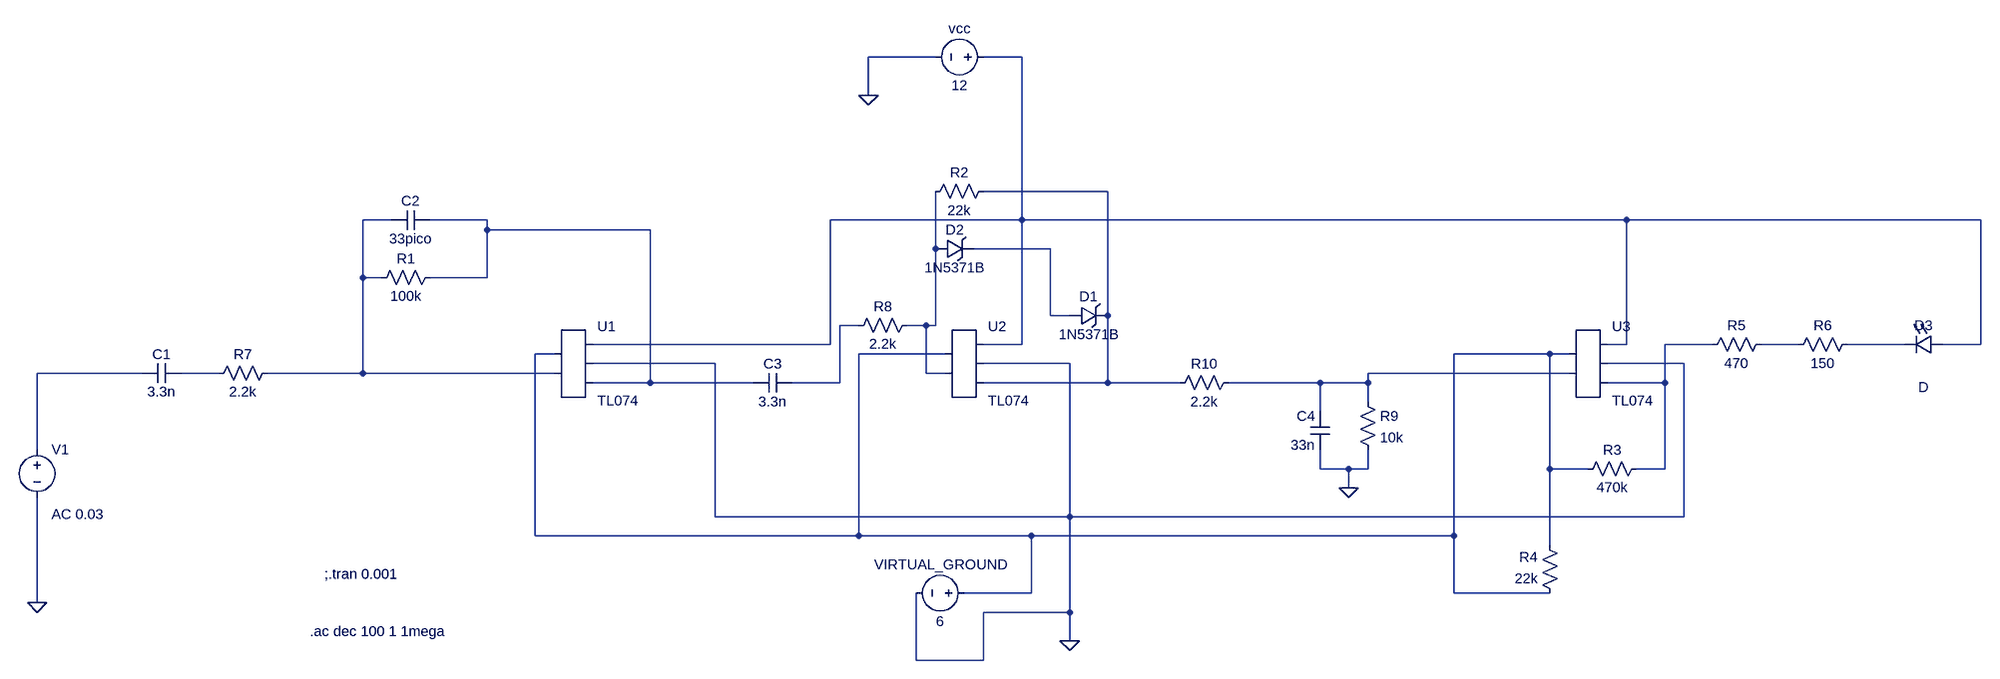
[diagram p0: schematic LTSPICE SIM.asc]
LTSPICE SIM.asc, the LTspice schematic file:
Version 4
SHEET 1 1336 728
WIRE -480 -320 -592 -320
WIRE -336 -320 -400 -320
WIRE -592 -256 -592 -320
WIRE -192 -80 -400 -80
WIRE -1392 -32 -1440 -32
WIRE -1232 -32 -1328 -32
WIRE -336 -32 -336 -320
WIRE -336 -32 -656 -32
WIRE 736 -32 -336 -32
WIRE 1328 -32 736 -32
WIRE -1232 -16 -1232 -32
WIRE -960 -16 -1232 -16
WIRE -480 16 -480 -80
WIRE -288 16 -416 16
WIRE -1440 64 -1440 -32
WIRE -1408 64 -1440 64
WIRE -1232 64 -1232 -16
WIRE -1232 64 -1328 64
WIRE -288 128 -288 16
WIRE -256 128 -288 128
WIRE -192 128 -192 -80
WIRE -608 144 -640 144
WIRE -496 144 -528 144
WIRE -480 144 -480 16
WIRE -480 144 -496 144
WIRE -656 176 -656 -32
WIRE -656 176 -1056 176
WIRE -336 176 -336 -32
WIRE -336 176 -400 176
WIRE 736 176 736 -32
WIRE 736 176 704 176
WIRE 880 176 800 176
WIRE 1024 176 960 176
WIRE 1200 176 1104 176
WIRE 1328 176 1328 -32
WIRE 1328 176 1264 176
WIRE -1120 192 -1152 192
WIRE -464 192 -608 192
WIRE 608 192 448 192
WIRE 640 192 608 192
WIRE -848 208 -1056 208
WIRE -256 208 -400 208
WIRE 832 208 704 208
WIRE -1808 224 -1984 224
WIRE -1680 224 -1744 224
WIRE -1440 224 -1440 64
WIRE -1440 224 -1600 224
WIRE -1120 224 -1440 224
WIRE -496 224 -496 144
WIRE -464 224 -496 224
WIRE 640 224 304 224
WIRE -960 240 -960 -16
WIRE -960 240 -1056 240
WIRE -784 240 -960 240
WIRE -640 240 -640 144
WIRE -640 240 -720 240
WIRE -192 240 -192 128
WIRE -192 240 -400 240
WIRE -16 240 -192 240
WIRE 224 240 64 240
WIRE 304 240 304 224
WIRE 304 240 224 240
WIRE 800 240 800 176
WIRE 800 240 704 240
WIRE 304 272 304 240
WIRE 224 288 224 240
WIRE -1984 352 -1984 224
WIRE 224 384 224 352
WIRE 272 384 224 384
WIRE 304 384 304 352
WIRE 304 384 272 384
WIRE 608 384 608 192
WIRE 672 384 608 384
WIRE 800 384 800 240
WIRE 800 384 752 384
WIRE 272 416 272 384
WIRE -848 464 -848 208
WIRE -256 464 -256 208
WIRE -256 464 -848 464
WIRE 832 464 832 208
WIRE 832 464 -256 464
WIRE -1152 496 -1152 192
WIRE -608 496 -608 192
WIRE -608 496 -1152 496
WIRE -320 496 -608 496
WIRE 448 496 448 192
WIRE 448 496 -320 496
WIRE 608 512 608 384
WIRE -320 592 -320 496
WIRE -320 592 -432 592
WIRE 448 592 448 496
WIRE 608 592 448 592
WIRE -1984 608 -1984 432
WIRE -256 624 -256 464
WIRE -256 624 -400 624
WIRE -256 672 -256 624
WIRE -512 704 -512 592
WIRE -400 704 -400 624
WIRE -400 704 -512 704
FLAG -592 -256 0
FLAG -256 672 0
FLAG -1984 608 0
FLAG 272 416 0
SYMBOL zener -256 112 M90
WINDOW 0 0 32 VBottom 2
WINDOW 3 32 32 VTop 2
SYMATTR InstName D1
SYMATTR Value 1N5371B
SYMATTR Description Diode
SYMATTR Type diode
SYMBOL zener -480 0 M90
WINDOW 0 0 32 VBottom 2
WINDOW 3 32 32 VTop 2
SYMATTR InstName D2
SYMATTR Value 1N5371B
SYMATTR Description Diode
SYMATTR Type diode
SYMBOL AutoGenerated\\TL074 -1088 208 R0
SYMATTR InstName U1
SYMBOL AutoGenerated\\TL074 -432 208 R0
SYMATTR InstName U2
SYMBOL AutoGenerated\\TL074 672 208 R0
SYMATTR InstName U3
SYMBOL voltage -384 -320 R90
WINDOW 0 -32 56 VBottom 2
WINDOW 3 32 56 VTop 2
WINDOW 123 0 0 Left 0
WINDOW 39 0 0 Left 0
SYMATTR InstName vcc
SYMATTR Value 12
SYMBOL voltage -416 592 R90
WINDOW 0 -32 56 VBottom 2
WINDOW 3 32 56 VTop 2
WINDOW 123 0 0 Left 0
WINDOW 39 0 0 Left 0
SYMATTR InstName VIRTUAL_GROUND
SYMATTR Value 6
SYMBOL res -1312 48 R90
WINDOW 0 0 56 VBottom 2
WINDOW 3 32 56 VTop 2
SYMATTR InstName R1
SYMATTR Value 100k
SYMBOL res -384 -96 R90
WINDOW 0 0 56 VBottom 2
WINDOW 3 32 56 VTop 2
SYMATTR InstName R2
SYMATTR Value 22k
SYMBOL res 768 368 R90
WINDOW 0 0 56 VBottom 2
WINDOW 3 32 56 VTop 2
SYMATTR InstName R3
SYMATTR Value 470k
SYMBOL res 624 608 R180
WINDOW 0 36 76 Left 2
WINDOW 3 36 40 Left 2
SYMATTR InstName R4
SYMATTR Value 22k
SYMBOL res 864 192 R270
WINDOW 0 32 56 VTop 2
WINDOW 3 0 56 VBottom 2
SYMATTR InstName R5
SYMATTR Value 470
SYMBOL res 1008 192 R270
WINDOW 0 32 56 VTop 2
WINDOW 3 0 56 VBottom 2
SYMATTR InstName R6
SYMATTR Value 150
SYMBOL res -1696 240 R270
WINDOW 0 32 56 VTop 2
WINDOW 3 0 56 VBottom 2
SYMATTR InstName R7
SYMATTR Value 2.2k
SYMBOL res -624 160 R270
WINDOW 0 32 56 VTop 2
WINDOW 3 0 56 VBottom 2
SYMATTR InstName R8
SYMATTR Value 2.2k
SYMBOL cap -1744 208 R90
WINDOW 0 0 32 VBottom 2
WINDOW 3 32 32 VTop 2
SYMATTR InstName C1
SYMATTR Value 3.3n
SYMBOL cap -1328 -48 R90
WINDOW 0 0 32 VBottom 2
WINDOW 3 32 32 VTop 2
SYMATTR InstName C2
SYMATTR Value 33pico
SYMBOL cap -720 224 R90
WINDOW 0 0 32 VBottom 2
WINDOW 3 32 32 VTop 2
SYMATTR InstName C3
SYMATTR Value 3.3n
SYMBOL cap 240 352 R180
WINDOW 0 24 56 Left 2
WINDOW 3 24 8 Left 2
SYMATTR InstName C4
SYMATTR Value 33n
SYMBOL res 288 256 R0
SYMATTR InstName R9
SYMATTR Value 10k
SYMBOL voltage -1984 336 R0
WINDOW 123 24 124 Left 2
WINDOW 39 0 0 Left 0
SYMATTR Value2 AC 0.03
SYMATTR InstName V1
SYMATTR Value ""
SYMBOL res 80 224 R90
WINDOW 0 0 56 VBottom 2
WINDOW 3 32 56 VTop 2
SYMATTR InstName R10
SYMATTR Value 2.2k
SYMBOL LED 1264 160 R90
WINDOW 0 0 32 VBottom 2
WINDOW 3 72 32 VTop 2
SYMATTR InstName D3
TEXT -1504 560 Left 2 !;.tran 0.001
TEXT -1528 656 Left 2 !.ac dec 100 1 1mega

The netlist it stands for:
* LTSPICE SIM.asc
D1 N006 N002 1N5371B
D2 N005 N006 1N5371B
* U1: TL074 (symbol AutoGenerated\TL074 not available, pins judged from their places): pin1=N011 pin2=N003 pin3=N001 pin4=0 pin5=N004
* U2: TL074 (symbol AutoGenerated\TL074 not available, pins judged from their places): pin1=N011 pin2=N005 pin3=N001 pin4=0 pin5=N002
* U3: TL074 (symbol AutoGenerated\TL074 not available, pins judged from their places): pin1=N011 pin2=N014 pin3=N001 pin4=0 pin5=N008
vcc N001 0 12
VIRTUAL_GROUND N011 0 6
R1 N004 N003 100k
R2 N002 N005 22k
R3 N008 N011 470k
R4 N011 N011 22k
R5 N008 N009 470
R6 N009 N010 150
R7 N013 N003 2.2k
R8 N007 N005 2.2k
C1 N013 N012 3.3n
C2 N004 N003 33pico
C3 N007 N004 3.3n
C4 0 N014 33n
R9 N014 0 10k
V1 N012 0 AC 0.03
R10 N014 N002 2.2k
D3 N001 N010 D
.model D D
.lib standard.dio
;.tran 0.001
.ac dec 100 1 1mega
.backanno
.end